# EAGLE schematic PiedPiper_Camera_PCB_v39 (EAGLE 9.7.0)
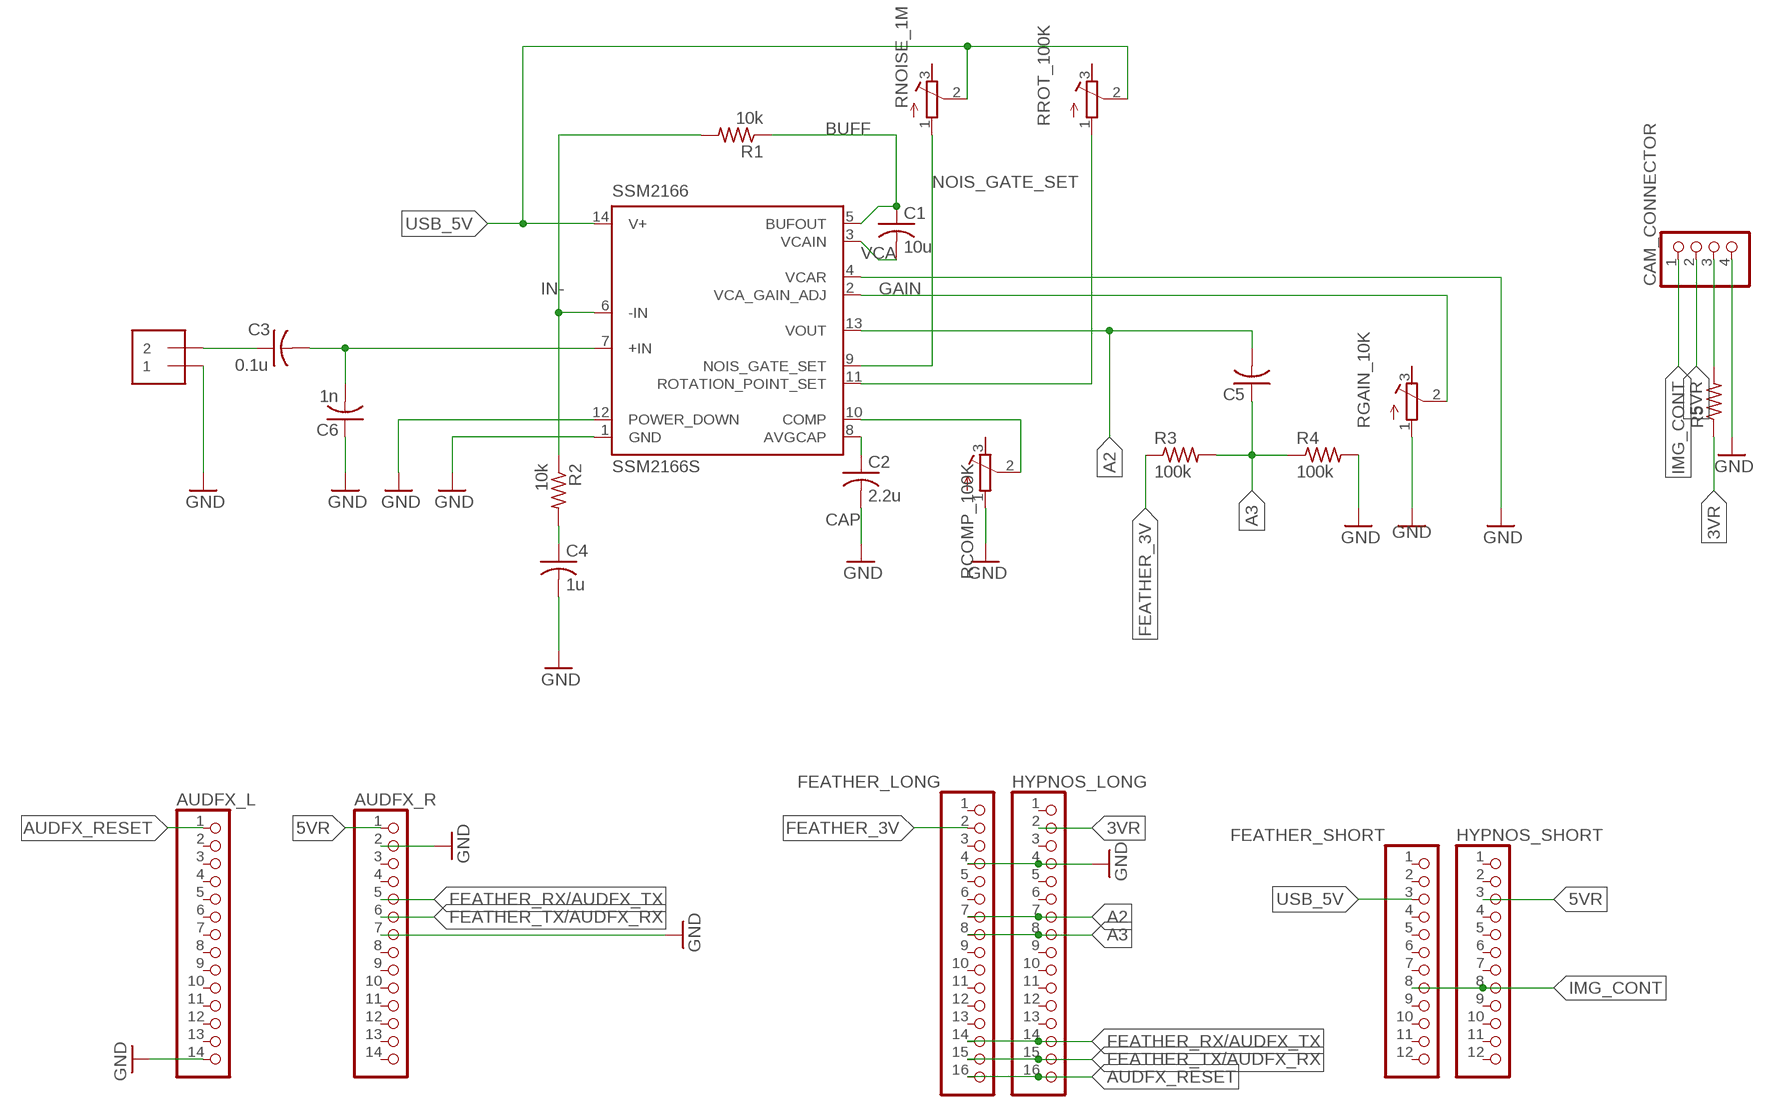
[diagram p0: schematic, sheet 1]

## Parts
AUDFX_L  PINHD-1X14_2.54-S  [1X14-S]
AUDFX_R  PINHD-1X14_2.54-S  [1X14-S]
AUDIO_IN  1X2-3.5MM  [1X2-3.5MM]
C1  10u  C-USC0805  [C0805]
C2  2.2u  C-USC0805  [C0805]
C3  0.1u  C-USC0805  [C0805]
C4  1u  C-USC0805  [C0805]
C5  C-USC0805  [C0805]
C6  1n  C-USC0805  [C0805]
CAM_CONNECTOR  PINHD-1X4  [1X04]
FEATHER_LONG  PINHD-1X16_2.54-S  [1X16-S]
FEATHER_SHORT  PINHD-1X12_2.54-S  [1X12-S]
HYPNOS_LONG  PINHD-1X16_2.54-S  [1X16-S]
HYPNOS_SHORT  PINHD-1X12_2.54-S  [1X12-S]
R1  10k  R-US_R1206  [R1206]
R2  10k  R-US_R1206  [R1206]
R3  100k  R-US_R1206  [R1206]
R4  100k  R-US_R1206  [R1206]
R5  R-US_R1206  [R1206]
RCOMP_100K  R-TRIMM3296Y  [RTRIM3296Y]
RGAIN_10K  R-TRIMM3296Y  [RTRIM3296Y]
RNOISE_1M  R-TRIMM3296Y  [RTRIM3296Y]
RROT_100K  R-TRIMM3296Y  [RTRIM3296Y]
SSM2166  SSM2166S  [SO14]

## Nets
3VR: HYPNOS_LONG.2 R5.1
5VR: AUDFX_R.1 CAM_CONNECTOR.2 HYPNOS_SHORT.3
+IN: C3.2 C6.2 SSM2166.7(+IN)
A2: C5.2 FEATHER_LONG.7 HYPNOS_LONG.7 SSM2166.13(VOUT)
A3: C5.1 FEATHER_LONG.8 HYPNOS_LONG.8 R3.2 R4.1
AUDFX_RESET: AUDFX_L.1 FEATHER_LONG.16 HYPNOS_LONG.16
BUFF: C1.1 R1.1 SSM2166.5(BUFOUT)
CAP: C2.1 SSM2166.8(AVGCAP)
COMP: RCOMP_100K.2(S) SSM2166.10(COMP)
FEATHER_3V: FEATHER_LONG.2 R3.1
FEATHER_RX/AUDFX_TX: AUDFX_R.5 FEATHER_LONG.14 HYPNOS_LONG.14
FEATHER_TX/AUDFX_RX: AUDFX_R.6 FEATHER_LONG.15 HYPNOS_LONG.15
GAIN: RGAIN_10K.2(S) SSM2166.2(VCA_GAIN_ADJ)
GND: AUDFX_L.14 AUDFX_R.2 AUDFX_R.7 AUDIO_IN.1 C2.2 C4.2 C6.1 CAM_CONNECTOR.4 FEATHER_LONG.4 HYPNOS_LONG.4 R4.2 RCOMP_100K.1(A) RGAIN_10K.1(A) SSM2166.1(GND) SSM2166.4(VCAR) SSM2166.12(POWER_DOWN)
IMG_CONT: CAM_CONNECTOR.1 FEATHER_SHORT.8 HYPNOS_SHORT.8
IN-: R1.2 R2.1 SSM2166.6(-IN)
N$1: CAM_CONNECTOR.3 R5.2
N$2: AUDIO_IN.2 C3.1
N$15: C4.1 R2.2
NOIS_GATE_SET: RNOISE_1M.1(A) SSM2166.9(NOIS_GATE_SET)
ROTATION_POINT_SET: RROT_100K.1(A) SSM2166.11(ROTATION_POINT_SET)
USB_5V: FEATHER_SHORT.3 RNOISE_1M.2(S) RROT_100K.2(S) SSM2166.14(V+)
VCA: C1.2 SSM2166.3(VCAIN)
Unconnected: AUDFX_L.2 AUDFX_L.3 AUDFX_L.4 AUDFX_L.5 AUDFX_L.6 AUDFX_L.7 AUDFX_L.8 AUDFX_L.9 AUDFX_L.10 AUDFX_L.11 AUDFX_L.12 AUDFX_L.13 AUDFX_R.3 AUDFX_R.4 AUDFX_R.8 AUDFX_R.9 AUDFX_R.10 AUDFX_R.11 AUDFX_R.12 AUDFX_R.13 AUDFX_R.14 FEATHER_LONG.1 FEATHER_LONG.3 FEATHER_LONG.5 FEATHER_LONG.6 FEATHER_LONG.9 FEATHER_LONG.10 FEATHER_LONG.11 FEATHER_LONG.12 FEATHER_LONG.13 FEATHER_SHORT.1 FEATHER_SHORT.2 FEATHER_SHORT.4 FEATHER_SHORT.5 FEATHER_SHORT.6 FEATHER_SHORT.7 FEATHER_SHORT.9 FEATHER_SHORT.10 FEATHER_SHORT.11 FEATHER_SHORT.12 HYPNOS_LONG.1 HYPNOS_LONG.3 HYPNOS_LONG.5 HYPNOS_LONG.6 HYPNOS_LONG.9 HYPNOS_LONG.10 HYPNOS_LONG.11 HYPNOS_LONG.12 HYPNOS_LONG.13 HYPNOS_SHORT.1 HYPNOS_SHORT.2 HYPNOS_SHORT.4 HYPNOS_SHORT.5 HYPNOS_SHORT.6 HYPNOS_SHORT.7 HYPNOS_SHORT.9 HYPNOS_SHORT.10 HYPNOS_SHORT.11 HYPNOS_SHORT.12 RCOMP_100K.3(E) RGAIN_10K.3(E) RNOISE_1M.3(E) RROT_100K.3(E)

## Library data of the parts
AUDFX_L AUDFX_R = pinhead-2:PINHD-1X14: PIN HEADER
AUDIO_IN = adafruit:1X2: 3.5mm Terminal block http://www.ladyada.net/library/pcb/eaglelibrary.html
C1-C6 = rcl:C-US: CAPACITOR, American symbol; SPICEPREFIX: C
CAM_CONNECTOR = pinhead:PINHD-1X4: PIN HEADER
FEATHER_LONG HYPNOS_LONG = pinhead-2:PINHD-1X16: PIN HEADER
FEATHER_SHORT HYPNOS_SHORT = pinhead-2:PINHD-1X12: PIN HEADER
R1-R5 = rcl:R-US_: RESISTOR, American symbol; SPICEPREFIX: R
RCOMP_100K RGAIN_10K RNOISE_1M RROT_100K = rcl:R-TRIMM: Trimm resistor; SPICEMODEL: X; SPICEPREFIXL: POT
SSM2166 = SSM2166:SSM2166: Microphone Preamplifier with Variable Compression and Noise Gating Source: http://www.analog.com/static/imported-files/data_sheets/SSM2166.pdf; AVAILABILITY: Unavailable; DESCRIPTION: ADI MICROPHONE PREAMP W/VAR COMPRESS; MF: Analog Devices; MP: SSM2166; PACKAGE: None; PRICE: None; SPICEPREFIX: X